# EAGLE design sprocket_clock (EAGLE 7.1.0)
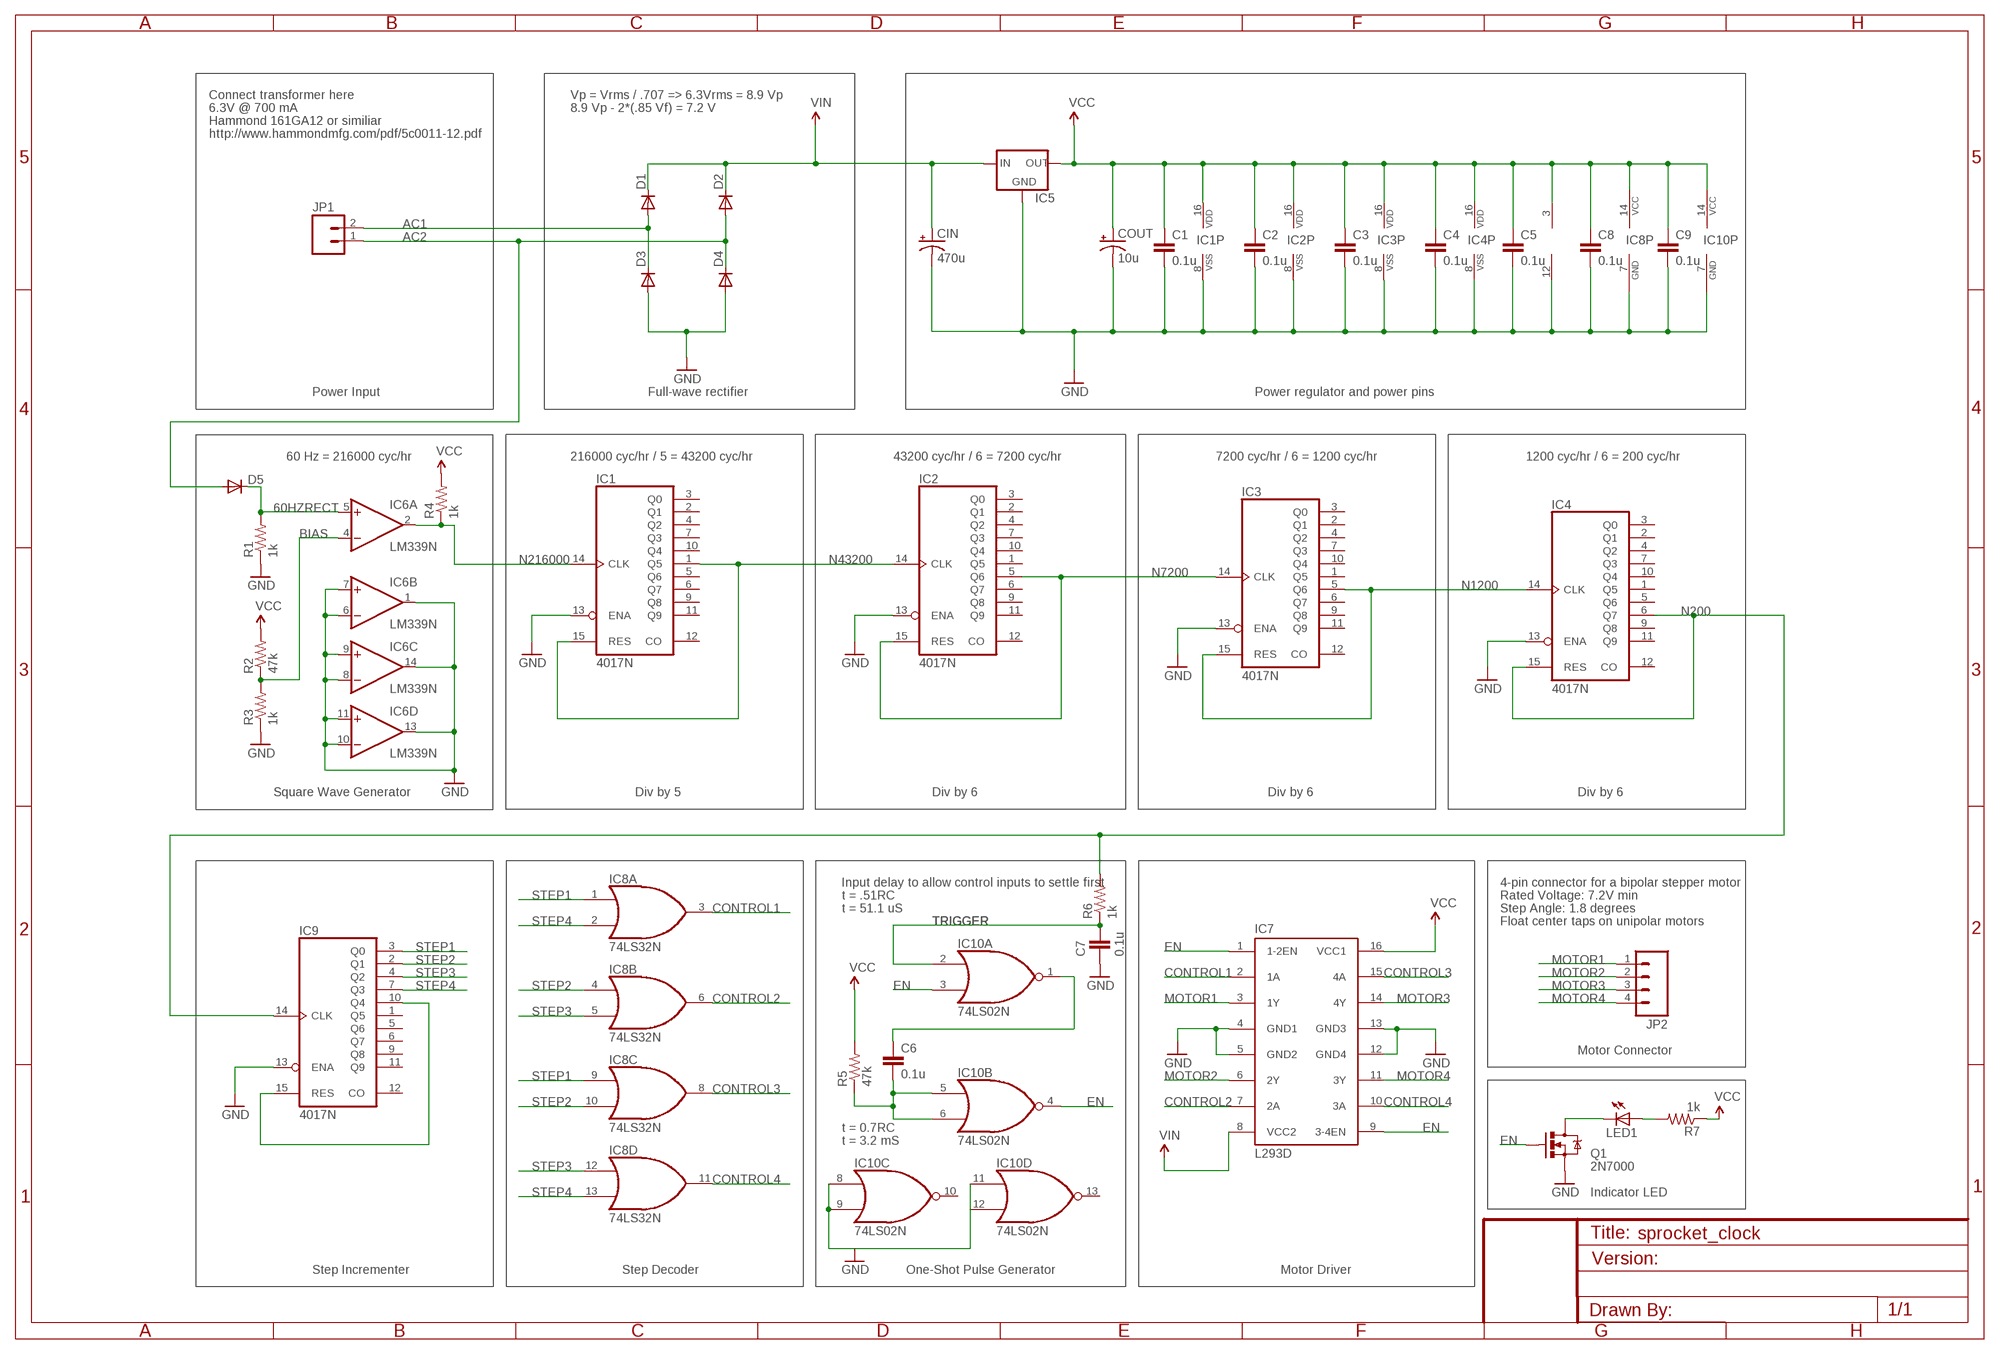
[diagram p0: schematic, sheet 1]

## Parts
C1  0.1u  CAPPTH1  [CAP-PTH-5MM]
C2  0.1u  CAPPTH1  [CAP-PTH-5MM]
C3  0.1u  CAPPTH1  [CAP-PTH-5MM]
C4  0.1u  CAPPTH1  [CAP-PTH-5MM]
C5  0.1u  CAPPTH1  [CAP-PTH-5MM]
C6  0.1u  CAPPTH1  [CAP-PTH-5MM]
C7  0.1u  CAPPTH1  [CAP-PTH-5MM]
C8  0.1u  CAPPTH1  [CAP-PTH-5MM]
C9  0.1u  CAPPTH1  [CAP-PTH-5MM]
CIN  470u  CAP_POLPTH3  [CPOL-RADIAL-1000UF-63V]
COUT  10u  CAP_POLPTH2  [CPOL-RADIAL-10UF-25V]
D1  DIODEPTH  [DIODE-1N4001]
D2  DIODEPTH  [DIODE-1N4001]
D3  DIODEPTH  [DIODE-1N4001]
D4  DIODEPTH  [DIODE-1N4001]
D5  DIODEPTH  [DIODE-1N4001]
IC1  4017N  [DIL16]
IC2  4017N  [DIL16]
IC3  4017N  [DIL16]
IC4  4017N  [DIL16]
IC5  V_REG_78XXTO-92  [TO-92]
IC6  LM339N  [DIL14]
IC7  L293D  [DIL16]
IC8  74LS32N  [DIL14]
IC9  4017N  [DIL16]
IC10  74LS02N  [DIL14]
JP1  M023.5MM-NO_SILK  [SCREWTERMINAL-3.5MM-2-NS]
JP2  M04SCREW  [SCREWTERMINAL-3.5MM-4]
LED1  LED5MM  [LED5MM]
Q1  2N7000  MOSFET-NCHANNEL2N7000  [TO-92]
R1  1k  RESISTORPTH-1/4W  [AXIAL-0.4]
R2  47k  RESISTORPTH-1/4W  [AXIAL-0.4]
R3  1k  RESISTORPTH-1/4W  [AXIAL-0.4]
R4  1k  RESISTORPTH-1/4W  [AXIAL-0.4]
R5  47k  RESISTORPTH-1/4W  [AXIAL-0.4]
R6  1k  RESISTORPTH-1/4W  [AXIAL-0.4]
R7  1k  RESISTORPTH-1/4W  [AXIAL-0.4]

## Nets
60HZRECT: D5.C IC6.5(A:+IN) R1.P$2
AC1: D1.A D3.C JP1.2
AC2: D2.A D4.C D5.A JP1.1
BIAS: IC6.4(A:-IN) R2.P$1 R3.P$2
CONTROL1: IC7.2(1A) IC8.3(A:O)
CONTROL2: IC7.7(2A) IC8.6(B:O)
CONTROL3: IC7.15(4A) IC8.8(C:O)
CONTROL4: IC7.10(3A) IC8.11(D:O)
EN: IC7.1(1-2EN) IC7.9(3-4EN) IC10.3(A:I1) IC10.4(B:O) Q1.2(G)
GND: C1.2 C2.2 C3.2 C4.2 C5.2 C7.2 C8.2 C9.2 CIN.2(-) COUT.2(-) D3.A D4.A IC1.8(VSS) IC1.13(ENA) IC2.8(VSS) IC3.8(VSS) IC4.8(VSS) IC5.1(GND) IC6.1(B:OUT) IC6.6(B:-IN) IC6.7(B:+IN) IC6.8(C:-IN) IC6.9(C:+IN) IC6.10(D:-IN) IC6.11(D:+IN) IC6.12(P:GND) IC6.13(D:OUT) IC6.14(C:OUT) IC7.4(GND1) IC7.5(GND2) IC7.12(GND4) IC7.13(GND3) IC8.7(P:GND) IC10.7(P:GND) Q1.1(S) R1.P$1 R3.P$1
MOTOR1: IC7.3(1Y) JP2.1
MOTOR2: IC7.6(2Y) JP2.2
MOTOR3: IC7.14(4Y) JP2.3
MOTOR4: IC7.11(3Y) JP2.4
N200: IC4.6(Q7) IC4.15(RES) IC9.14(CLK) R6.P$2
N1200: IC3.5(Q6) IC3.15(RES) IC4.14(CLK)
N7200: IC2.5(Q6) IC2.15(RES) IC3.14(CLK)
N43200: IC1.1(Q5) IC1.15(RES) IC2.14(CLK)
N216000: IC1.14(CLK) IC6.2(A:OUT) R4.P$1
N$1: LED1.A R7.P$2
N$2: IC9.10(Q4) IC9.15(RES)
N$4: C6.1 IC10.1(A:O)
N$5: C6.2 IC10.5(B:I0) IC10.6(B:I1) R5.P$1
N$6: LED1.K(C) Q1.3(D)
N$7: IC10.8(C:I0) IC10.9(C:I1) IC10.11(D:I0)
STEP1: IC8.1(A:I0) IC8.9(C:I0) IC9.3(Q0)
STEP2: IC8.4(B:I0) IC8.10(C:I1) IC9.2(Q1)
STEP3: IC8.5(B:I1) IC8.12(D:I0) IC9.4(Q2)
STEP4: IC8.2(A:I1) IC8.13(D:I1) IC9.7(Q3)
TRIGGER: C7.1 IC10.2(A:I0) R6.P$1
VCC: C1.1 C2.1 C3.1 C4.1 C5.1 C8.1 COUT.1(+) IC1.16(VDD) IC2.16(VDD) IC3.16(VDD) IC4.16(VDD) IC5.3(OUT) IC6.3(P:V+) IC7.16(VCC1) IC8.14(P:VCC) IC10.14(P:VCC) R2.P$2 R4.P$2 R5.P$2 R7.P$1
VIN: CIN.1(+) D1.C D2.C IC5.2(IN) IC7.8(VCC2)
Unconnected: C9.1 IC1.2(Q1) IC1.3(Q0) IC1.4(Q2) IC1.5(Q6) IC1.6(Q7) IC1.7(Q3) IC1.9(Q8) IC1.10(Q4) IC1.11(Q9) IC1.12(CO) IC2.1(Q5) IC2.2(Q1) IC2.3(Q0) IC2.4(Q2) IC2.6(Q7) IC2.7(Q3) IC2.9(Q8) IC2.10(Q4) IC2.11(Q9) IC2.12(CO) IC2.13(ENA) IC3.1(Q5) IC3.2(Q1) IC3.3(Q0) IC3.4(Q2) IC3.6(Q7) IC3.7(Q3) IC3.9(Q8) IC3.10(Q4) IC3.11(Q9) IC3.12(CO) IC3.13(ENA) IC4.1(Q5) IC4.2(Q1) IC4.3(Q0) IC4.4(Q2) IC4.5(Q6) IC4.7(Q3) IC4.9(Q8) IC4.10(Q4) IC4.11(Q9) IC4.12(CO) IC4.13(ENA) IC9.1(Q5) IC9.5(Q6) IC9.6(Q7) IC9.9(Q8) IC9.11(Q9) IC9.12(CO) IC9.13(ENA) IC10.10(C:O) IC10.12(D:I1) IC10.13(D:O)

## Notes on the sheet
- Connect transformer here | Vp = Vrms / .707 => 6.3Vrms = 8.9 Vp
- 6.3V @ 700 mA | 8.9 Vp - 2*(.85 Vf) = 7.2 V
- Hammond 161GA12 or similiar
- http://www.hammondmfg.com/pdf/5c0011-12.pdf
- Power Input | Full-wave rectifier | Power regulator and power pins
- 60 Hz = 216000 cyc/hr | 216000 cyc/hr / 5 = 43200 cyc/hr | 43200 cyc/hr / 6 = 7200 cyc/hr | 7200 cyc/hr / 6 = 1200 cyc/hr | 1200 cyc/hr / 6 = 200 cyc/hr
- Square Wave Generator | Div by 5 | Div by 6 | Div by 6 | Div by 6
- Input delay to allow control inputs to settle first | 4-pin connector for a bipolar stepper motor
- t = .51RC | Rated Voltage: 7.2V min
- t = 51.1 uS | Step Angle: 1.8 degrees
- Float center taps on unipolar motors
- Motor Connector
- t = 0.7RC
- t = 3.2 mS
- Indicator LED
- Step Incrementer | Step Decoder | One-Shot Pulse Generator | Motor Driver

## Power pins joined to a net without a drawn wire
VDD: IC9.16(VDD)
VSS: IC9.8(VSS)

## Library data of the parts
C1-C9 = SparkFun-Capacitors:CAP: Capacitor Standard 0603 ceramic capacitor, and 0.1" leaded capacitor.
CIN COUT = SparkFun-Capacitors:CAP_POL: Capacitor Polarized These are standard SMD and PTH capacitors. Normally 10uF, 47uF, and 100uF in electrolytic and tantalum varieties. Always verify the external diameter of the through hole cap, it varies with capacity, voltage, and manufacturer. The EIA devices should be standard.
D1-D5 = SparkFun-DiscreteSemi:DIODE: Diode These are standard reverse protection diodes and small signal diodes. SMA package can handle up to about 1A. SOD-323 can handle about 200mA. What the SOD-323 package when ordering, there are some mfgs out there that are 5-pin packages.
IC1-IC4 IC9 = 40xx:4017: COUNTER/DIVIDER
IC5 = SparkFun-PowerIC:V_REG_78XX: Voltage Regulator Standard 7805 5V regulator. IGO (Input Ground Output). Spark Fun Electronics SKU : COM-00107
IC6 = linear:LM339: Low Power Low Offset Voltage Quad Comparators with open collector; LM139/LM239/LM339/LM2901/LM3302
IC7 = st-microelectronics:L293D: PUSH-PULL 4 CHANNEL DRIVER; MPN: L293D; OC_FARNELL: 9589619; OC_NEWARK: 56P8249
IC8 = 74xx-us:74*32: Quad 2-input OR gate
IC10 = 74xx-us:74*02: Quad 2-input NOR gate
JP1 = SparkFun-Connectors:M02: Header 2 Standard 2-pin 0.1" header. Use with straight break away headers (SKU : PRT-00116), right angle break away headers (PRT-00553), swiss pins (PRT-00743), machine pins (PRT-00117), and female headers (PRT-00115). Molex polarized connector foot print use with SKU : PRT-08233 with associated crimp pins and housings.
JP2 = SparkFun-Connectors:M04: Header 4 Standard 4-pin 0.1" header. Use with straight break away headers (SKU : PRT-00116), right angle break away headers (PRT-00553), swiss pins (PRT-00743), machine pins (PRT-00117), and female headers (PRT-00115). Molex polarized connector foot print use with SKU : PRT-08231 with associated crimp pins and housings. 1MM SMD Version SKU: PRT-10208
LED1 = SparkFun-LED:LED: LEDs Standard schematic elements and footprints for 5mm, 3mm, 1206, and 0603 sized LEDs. 5mm - Spark Fun Electronics SKU : COM-00529 (and others)
Q1 = SparkFun-DiscreteSemi:MOSFET-NCHANNEL: Common NMOSFET Parts MFG P/N Store ID Prod ID FDD8780 TRANS-09984 SI7820DN TRANS-11055 FDS6630A IC-08089 2N7002PW TRANS-11151 FQP30N06L COM-10213 TRANS-10060 BSS123LT1G TRANS-08345 BSS138 TRANS-00830 BS170 2N7000
R1-R7 = SparkFun-Passives:RESISTOR: Resistor Basic schematic elements and footprints for 0603, 1206, and PTH resistors.

## Board
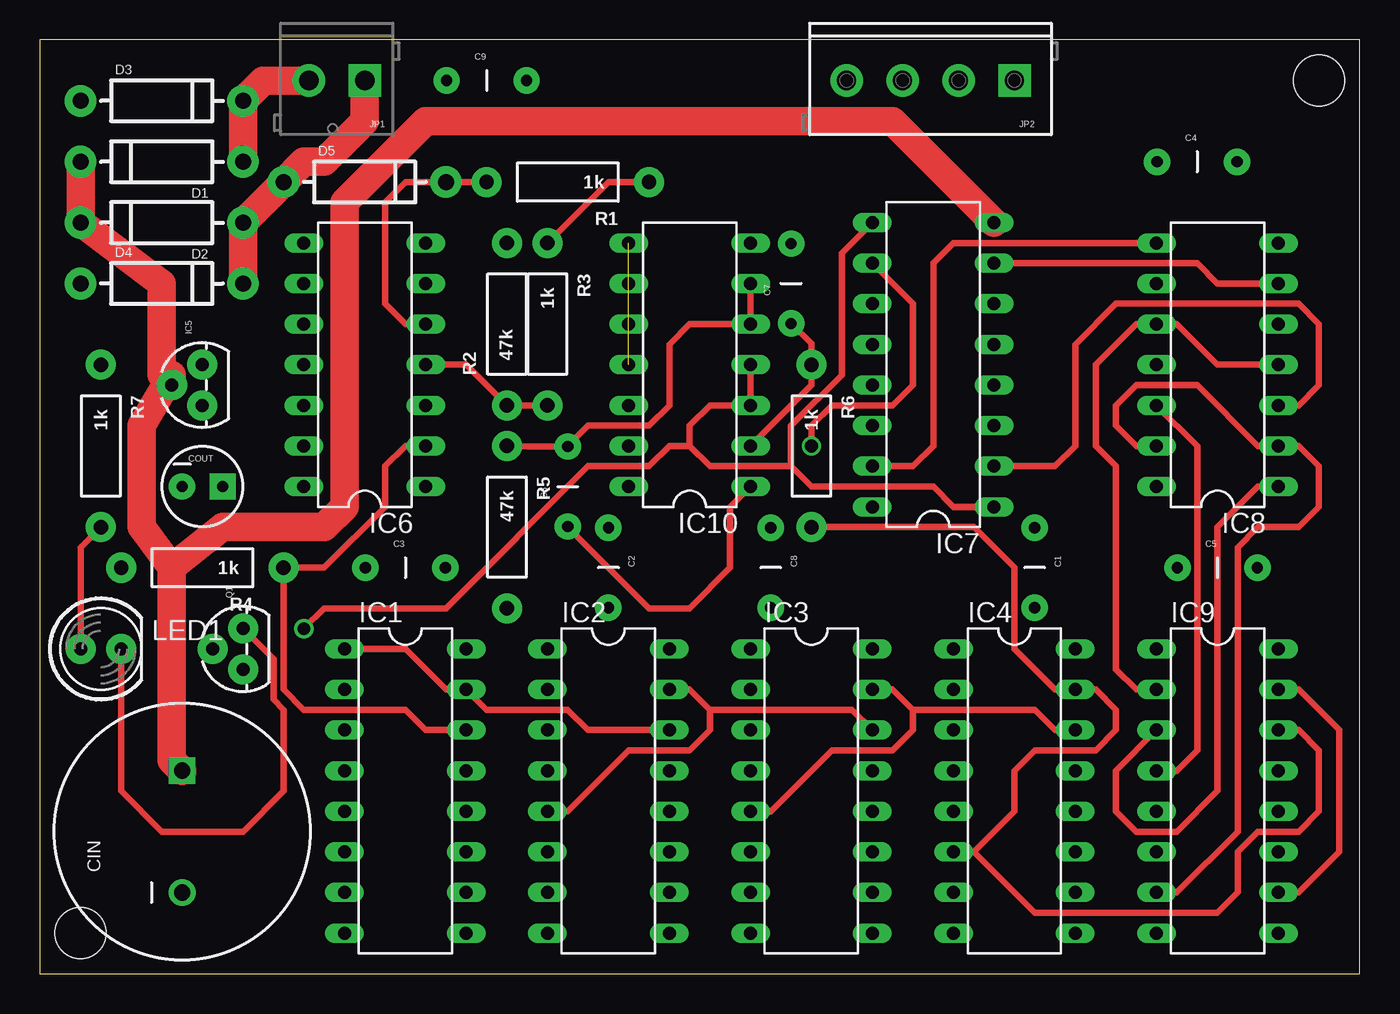
[diagram p1: board, top side]
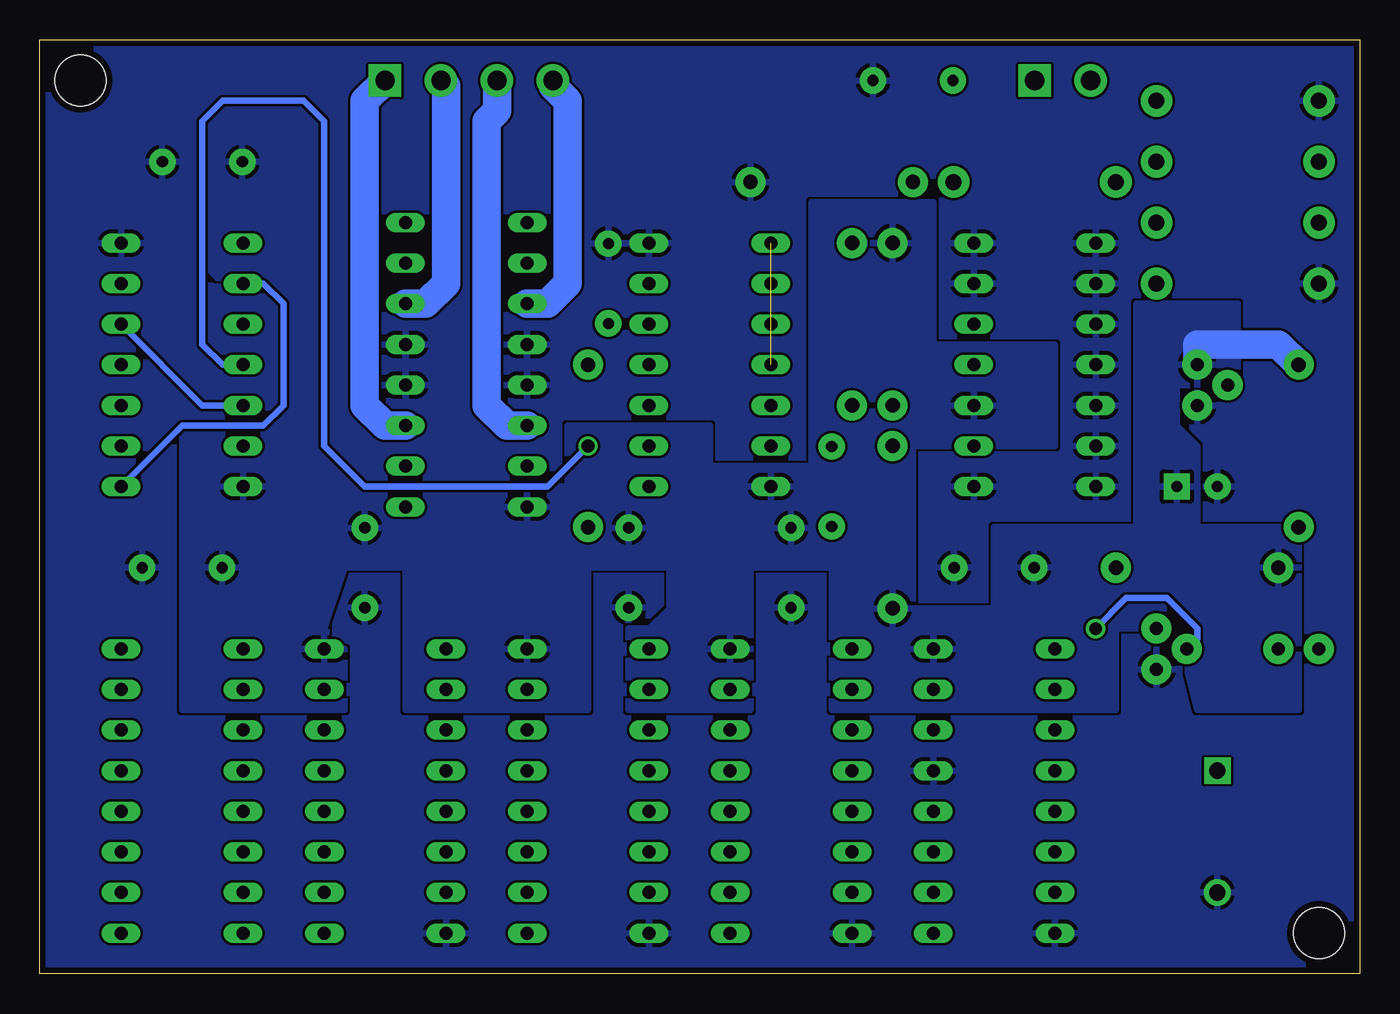
[diagram p2: board, bottom side, seen from below]

Size 82.55 x 58.42 mm. Coordinates in mm from the lower left corner, seen from the top.
Outline: 0,0 82.55,0 82.55,58.42 0,58.42 0,0
Copper layers (1*16): Top 0.0356mm / dielectric 1.5011mm / Bottom 0.0356mm
Design rules "LaenPCBOrder": minimum track width 6mil, minimum drill 13mil, track to track 6mil, track to pad 6mil, pad to pad 6mil, via to via 6mil, smd to smd 6mil, copper to edge 15mil, drill to drill 6mil, minimum pad ring 7mil, minimum via ring 7mil, stop-mask expansion 4mil, vias tented up to drill 0mil, thermal gap 10mil
Holes 3.2 mm at 2.54,2.54 80.01,55.88

### Footprints (pad centres in the part's own frame; a part is rotated, then mirrored left to right if it is on the bottom)
CAP-PTH-5MM = drill 0.7 pad 1.651: 1 -2.5,0; 2 2.5,0
CPOL-RADIAL-1000UF-63V = drill 1.016 pad 1.651 square: 1 3.81,0 | drill 1.016 pad 1.676: 2 -3.81,0
CPOL-RADIAL-10UF-25V = drill 0.7 pad 1.651 square: 1 1.27,0 | drill 0.7 pad 1.651: 2 -1.27,0
DIODE-1N4001 = drill 1 pad 1.981: A -5.08,0; C 5.08,0
DIL16 = drill 0.813 long: 1 -8.89,-3.81; 2 -6.35,-3.81; 3 -3.81,-3.81; 4 -1.27,-3.81; 5 1.27,-3.81; 6 3.81,-3.81; 7 6.35,-3.81; 8 8.89,-3.81; 9 8.89,3.81; 10 6.35,3.81; 11 3.81,3.81; 12 1.27,3.81; 13 -1.27,3.81; 14 -3.81,3.81; 15 -6.35,3.81; 16 -8.89,3.81
TO-92 = drill 0.813 pad 1.88: 1 -1.27,0; 2 0,1.905; 3 1.27,0
DIL14 = drill 0.813 long: 1 -7.62,-3.81; 2 -5.08,-3.81; 3 -2.54,-3.81; 4 0,-3.81; 5 2.54,-3.81; 6 5.08,-3.81; 7 7.62,-3.81; 8 7.62,3.81; 9 5.08,3.81; 10 2.54,3.81; 11 0,3.81; 12 -2.54,3.81; 13 -5.08,3.81; 14 -7.62,3.81
SCREWTERMINAL-3.5MM-2-NS = drill 1.2 pad 2.032 square: 1 0,0 | drill 1.2 pad 2.032: 2 3.5,0
SCREWTERMINAL-3.5MM-4 = drill 1.2 pad 2.032 square: 1 0,0 | drill 1.2 pad 2.032: 2 3.5,0; 3 7,0; 4 10.5,0
LED5MM = drill 0.813 pad 1.88: A -1.27,0; K 1.27,0
AXIAL-0.4 = drill 0.9 pad 1.88: P$1 -5.08,0; P$2 5.08,0

### Placement (x,y rotation side)
C1  62.23,25.4 270 top
C2  35.56,25.4 270 top
C3  22.86,25.4 0 top
C4  72.39,50.8 0 top
C5  73.66,25.4 0 top
C6  33.02,30.48 90 top
C7  46.99,43.18 90 top
C8  45.72,25.4 270 top
C9  27.94,55.88 0 top
CIN  8.89,8.89 90 top
COUT  10.16,30.48 0 top
D1  7.62,50.8 180 top
D2  7.62,46.99 180 top
D3  7.62,54.61 0 top
D4  7.62,43.18 0 top
D5  20.32,49.53 0 top
IC1  22.86,11.43 270 top
IC2  35.56,11.43 270 top
IC3  48.26,11.43 270 top
IC4  60.96,11.43 270 top
IC5  10.16,36.83 90 top
IC6  20.32,38.1 90 top
IC7  55.88,38.1 90 top
IC8  73.66,38.1 90 top
IC9  73.66,11.43 270 top
IC10  40.64,38.1 90 top
JP1  20.32,55.88 180 top
JP2  60.96,55.88 180 top
LED1  3.81,20.32 0 top
Q1  12.7,20.32 90 top
R1  33.02,49.53 180 top
R2  29.21,40.64 90 top
R3  31.75,40.64 270 top
R4  10.16,25.4 180 top
R5  29.21,27.94 270 top
R6  48.26,33.02 270 top
R7  3.81,33.02 270 top

### Tracks (layer width: path | path; a pad name or v marks a point on that pad's centre or on a via)
60HZRECT
  Top 0.406: R1.P$2 D5.C 22.86,49.53 21.59,48.26 21.59,41.91 22.86,40.64 IC6.5
AC1
  Top 1.778: JP1.2 13.97,55.88 D3.C D1.A
AC2
  Top 1.778: JP1.1 20.32,53.34 17.78,50.8 16.51,50.8 D5.A D2.A D4.C
BIAS
  Top 0.406: IC6.4 26.67,38.1 R2.P$1 R3.P$2
CONTROL1
  Top 0.406: IC7.2 63.5,31.75 64.77,33.02 64.77,39.37 67.31,41.91 78.74,41.91 80.01,40.64 80.01,36.83 78.74,35.56 IC8.3
CONTROL2
  Top 0.406: IC8.6 73.66,43.18 72.39,44.45 IC7.7
CONTROL3
  Top 0.406: IC8.8 57.15,45.72 55.88,44.45 55.88,33.02 54.61,31.75 IC7.15
CONTROL4  (via drill 0.8)
  Top 0.406: v48.26,33.02 48.26,34.29 49.53,35.56 53.34,35.56 54.61,36.83 54.61,41.91 IC7.10
  Bottom 0.406: IC8.11 71.12,38.1 72.39,39.37 72.39,53.34 71.12,54.61 66.04,54.61 64.77,53.34 64.77,33.02 62.23,30.48 50.8,30.48 v48.26,33.02
EN  (via drill 0.8)
  Top 0.406: IC10.4 IC10.3 41.91,35.56 40.64,34.29 40.64,33.02 | 46.99,31.75 48.26,30.48 55.88,30.48 57.15,29.21 IC7.1 | 46.99,31.75 41.91,31.75 40.64,33.02 | IC7.9 50.17,45.09 50.17,37.46 46.99,34.29 46.99,31.75 | 40.64,33.02 39.37,33.02 38.1,31.75 34.29,31.75 25.4,22.86 17.78,22.86 v16.51,21.59
  Bottom 0.406: v16.51,21.59 14.61,23.5 12.07,23.5 10.16,21.59 10.16,20.96 Q1.2
GND
  Top 0.406: R1.P$1 35.56,49.53 R3.P$1
  pour Bottom (rank 2): 0,58.42 0,0 82.55,0 82.55,58.42
MOTOR1
  Bottom 1.778: IC7.3 60.96,34.29 62.23,35.56 62.23,54.61 JP2.1
MOTOR2
  Bottom 1.778: IC7.6 58.42,41.91 57.15,43.18 57.15,55.57 JP2.2
MOTOR3
  Bottom 1.778: JP2.3 53.96,53.99 54.61,53.34 54.61,35.56 53.34,34.29 IC7.14
MOTOR4
  Bottom 1.778: JP2.4 50.46,55.54 49.53,54.61 49.53,43.18 50.8,41.91 IC7.11
N200
  Top 0.406: 58.42,7.62 60.96,10.16 60.96,12.7 62.23,13.97 66.04,13.97 67.31,15.24 67.31,16.51 66.04,17.78 IC4.15 63.5,17.78 60.96,20.32 60.96,25.4 58.42,27.94 R6.P$2 | 58.42,7.62 IC4.6 | IC9.14 78.74,15.24 80.01,13.97 80.01,10.16 78.74,8.89 76.2,8.89 74.93,7.62 74.93,5.08 73.66,3.81 62.23,3.81 58.42,7.62
N1200
  Top 0.406: IC3.5 45.72,10.16 49.53,13.97 53.34,13.97 54.61,15.24 54.61,16.51 | 54.61,16.51 53.34,17.78 IC3.15 | IC4.14 63.5,15.24 62.23,16.51 54.61,16.51
N7200
  Top 0.406: IC2.15 40.64,17.78 41.91,16.51 | 41.91,16.51 50.8,16.51 IC3.14 | IC2.5 33.02,10.16 36.83,13.97 40.64,13.97 41.91,15.24 41.91,16.51
N43200
  Top 0.406: IC1.1 22.86,20.32 25.4,17.78 IC1.15 27.94,16.51 33.02,16.51 34.29,15.24 IC2.14
N216000
  Top 0.406: IC1.14 24.13,15.24 22.86,16.51 16.51,16.51 15.24,17.78 R4.P$1 17.78,25.4 21.59,29.21 21.59,31.75 22.86,33.02 IC6.2
N$1
  Top 0.406: R7.P$2 2.54,26.67 LED1.A
N$2
  Top 0.406: IC9.10 78.74,5.08 81.28,7.62 81.28,15.24 78.74,17.78 IC9.15
N$4
  Top 0.406: C6.1 34.25,26.71 38.1,22.86 40.64,22.86 43.18,25.4 43.18,29.21 IC10.1
N$5
  Top 0.406: R5.P$1 30.52,32.98 C6.2 33.02,33.02 34.29,34.29 38.1,34.29 39.37,35.56 39.37,39.37 40.64,40.64 IC10.5 IC10.6
N$6
  Top 0.406: LED1.K 5.08,11.43 7.62,8.89 12.7,8.89 15.24,11.43 15.24,16.51 14.61,17.14 14.61,19.69 Q1.3
N$7  (2 unrouted)
STEP1
  Top 0.406: IC9.3 67.31,12.7 67.31,10.16 68.58,8.89 71.12,8.89 73.66,11.43 73.66,27.94 76.2,30.48 IC8.1
  Bottom 0.406: IC8.9 68.58,43.18 67.31,41.91 67.31,35.56 68.58,34.29 73.66,34.29 IC8.1
STEP2
  Top 0.406: IC9.2 68.58,17.78 67.31,19.05 67.31,31.75 66.04,33.02 66.04,38.1 68.58,40.64 IC8.10 71.12,40.64 73.66,38.1 IC8.4
STEP3
  Top 0.406: IC9.4 71.12,12.7 72.39,13.97 72.39,33.02 IC8.12
  Bottom 0.406: IC8.12 72.39,35.56 IC8.5
STEP4
  Top 0.406: IC9.7 71.12,5.08 74.93,8.89 74.93,26.67 76.2,27.94 78.74,27.94 80.01,29.21 80.01,31.75 78.74,33.02 IC8.2 76.2,33.02 72.39,36.83 68.58,36.83 67.31,35.56 67.31,34.29 68.58,33.02 IC8.13
TRIGGER
  Top 0.406: C7.1 48.26,39.41 R6.P$1 48.26,36.83 IC10.2
VCC
  Bottom 1.778: R7.P$1 5.08,39.37 10.16,39.37 IC5.3
  pour Bottom: 26.67,39.37 19.05,39.37 19.05,33.02 27.94,33.02 27.94,22.86 22.86,22.86 22.86,27.94 13.97,27.94 13.97,41.91 7.62,41.91 7.62,36.83 11.43,36.83 11.43,34.29 10.16,33.02 10.16,27.94 3.81,27.94 3.81,16.51 10.16,16.51 11.43,21.59 15.24,21.59 15.24,16.51 33.02,16.51 33.02,25.4 38.1,25.4 38.1,16.51 45.72,16.51 45.72,21.59 44.45,21.59 43.18,22.86 43.18,25.4 48.26,25.4 48.26,16.51 59.69,16.51 59.69,25.4 63.5,25.4 64.77,21.59 63.5,20.32 63.5,16.51 73.66,16.51 73.66,34.29 68.58,34.29 67.31,35.56 67.31,41.91 68.58,43.18 71.12,43.18 72.39,44.45 72.39,53.34 71.12,54.61 66.04,54.61 64.77,53.34 64.77,33.02 62.23,30.48 49.53,30.48 49.53,34.29 40.64,34.29 40.64,31.75 34.29,31.75 34.29,48.26 26.67,48.26
VIN
  Top 1.778: D1.C D2.C 7.62,43.18 7.62,37.46 IC5.2 8.25,37.46 6.35,34.29 6.35,27.94 8.25,25.4 | 8.25,25.4 8.25,13.33 CIN.1 | IC7.8 53.34,53.34 24.13,53.34 19.05,48.26 19.05,29.21 17.78,27.94 11.43,27.94 8.25,25.4